# Altium schematic sheet OpenMoteSTM-Border_DP83848CVV.SchDoc
size A4
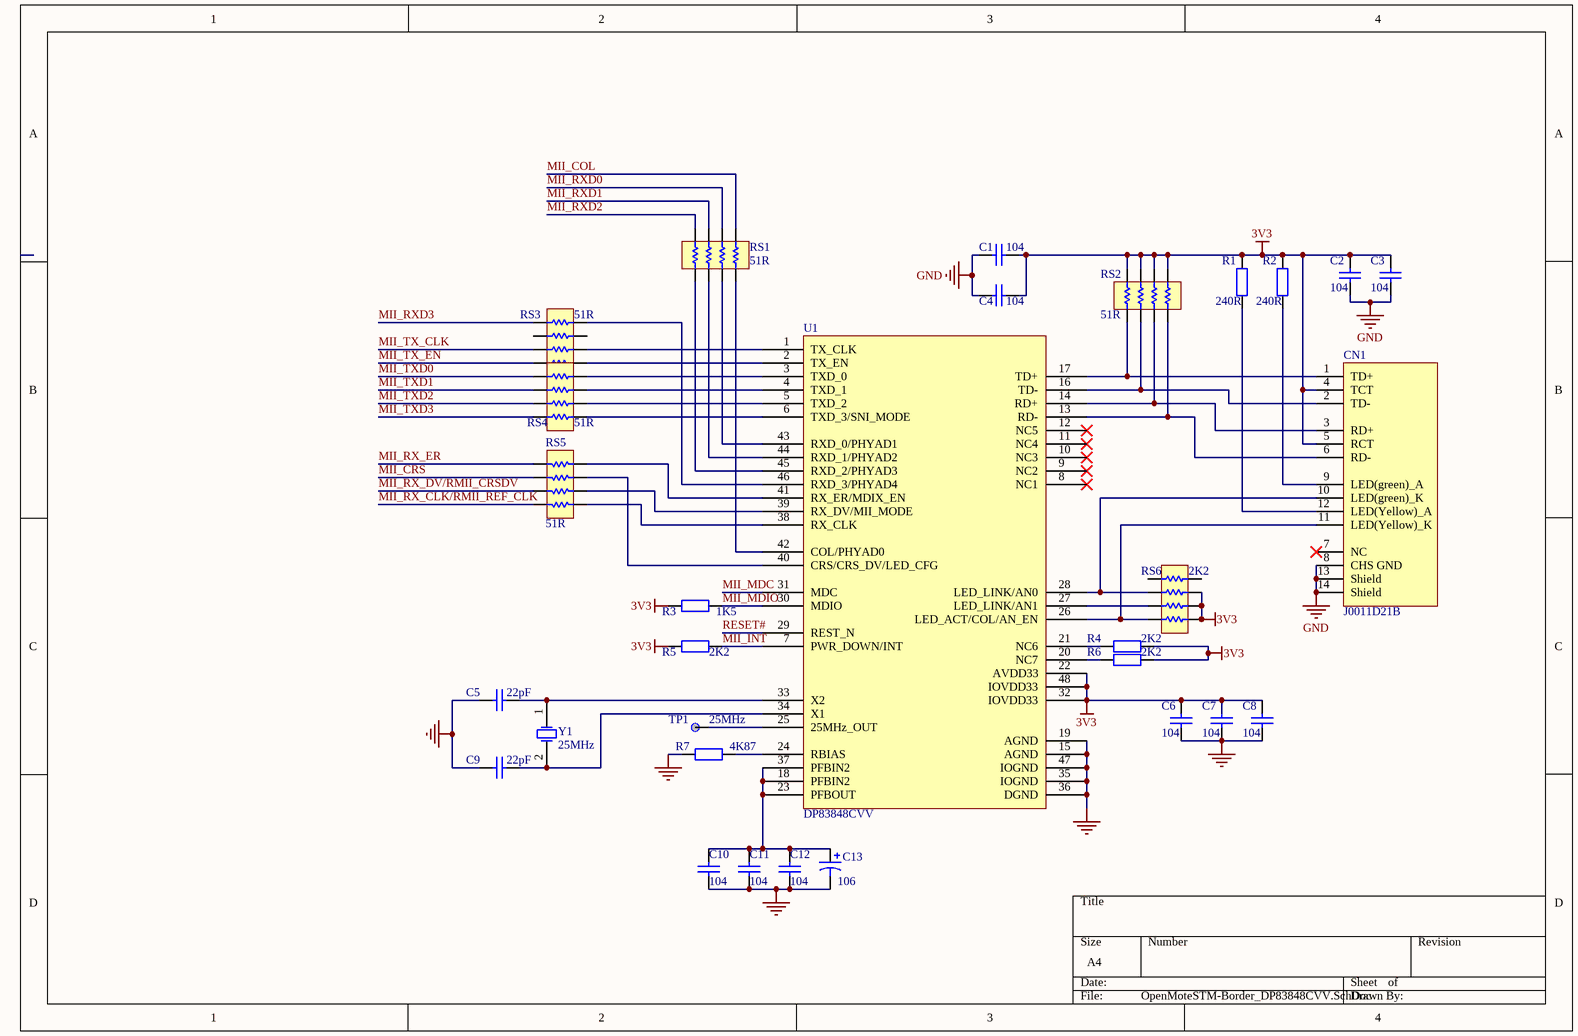
[diagram p0: OpenMoteSTM-Border_DP83848CVV.SchDoc]

## Parts
C1  value 104  [0603]  (hidden comment: Cap)
C2  value 104  [0603]  (hidden comment: Cap)
C3  value 104  [0603]  (hidden comment: Cap)
C4  value 104  [0603]  (hidden comment: Cap)
C5  value 22pF  [0603]  (hidden comment: Cap)
C6  value 104  [0603]  (hidden comment: Cap)
C7  value 104  [0603]  (hidden comment: Cap)
C8  value 104  [0603]  (hidden comment: Cap)
C9  value 22pF  [0603]  (hidden comment: Cap)
C10  value 104  [0603]  (hidden comment: Cap)
C11  value 104  [0603]  (hidden comment: Cap)
C12  value 104  [0603]  (hidden comment: Cap)
C13  value 106  [1210]  (hidden comment: Cap Pol1)
CN1  J0011D21B  [RJ45]
R1  value 240R  [0603]  (hidden comment: Res2)
R2  value 240R  [0603]  (hidden comment: Res2)
R3  value 1K5  [0603]  (hidden comment: Res2)
R4  value 2K2  [0603]  (hidden comment: Res2)
R5  value 2K2  [0603]  (hidden comment: Res2)
R6  value 2K2  [0603]  (hidden comment: Res2)
R7  value 4K87  [0603]  (hidden comment: Res2)
RS1  51R  [RES-4B]
RS2  51R  [RES-4B]
RS3  51R  [RES-4B]
RS4  51R  [RES-4B]
RS5  51R  [RES-4B]
RS6  2K2  [RES-4B]
TP1  25MHz  [TP]
U1  DP83848CVV  [DP83848CVV]
Y1  25MHz  [XTAL]

## Nets
3V3: C1.2 C2.2 C3.2 C4.2 C6.2 C7.2 C8.2 CN1.4(TCT) CN1.5(RCT) R1.2 R2.2 R3.1 R4.2 R5.1 R6.2 RS2.1 RS2.3 RS2.5 RS2.7 RS6.4 RS6.6 RS6.8 U1.22(AVDD33) U1.32(IOVDD33) U1.48(IOVDD33)
GND: C1.1 C2.1 C3.1 C4.1 C5.1 C6.1 C7.1 C8.1 C9.1 C10.1 C11.1 C12.1 C13.2 CN1.8(CHS_GND) CN1.13(Shield) CN1.14(Shield) R7.1 U1.15(AGND) U1.19(AGND) U1.35(IOGND) U1.36(DGND) U1.47(IOGND)
MII_COL: RS1.8
MII_CRS: RS5.4
MII_INT: R5.2 U1.7(PWR_DOWN/INT)
MII_MDC: U1.31(MDC)
MII_MDIO: R3.2 U1.30(MDIO)
MII_RX_CLK/RMII_REF_CLK: RS5.8
MII_RX_DV/RMII_CRSDV: RS5.6
MII_RX_ER: RS5.2
MII_RXD0: RS1.6
MII_RXD1: RS1.4
MII_RXD2: RS1.2
MII_RXD3: RS3.1
MII_TX_CLK: RS3.5
MII_TX_EN: RS3.7
MII_TXD0: RS4.1
MII_TXD1: RS4.3
MII_TXD2: RS4.5
MII_TXD3: RS4.7
RESET#: U1.29(REST_N)
NetC5_2: C5.2 U1.33(X2) Y1.1(OSC1)
NetC9_2: C9.2 U1.34(X1) Y1.2(OSC2)
NetC10_2: C10.2 C11.2 C12.2 C13.1 U1.18(PFBIN2) U1.23(PFBOUT) U1.37(PFBIN2)
NetCN1_1: CN1.1(TD+) RS2.8 U1.17(TD+)
NetCN1_2: CN1.2(TD-) RS2.6 U1.16(TD-)
NetCN1_3: CN1.3(RD+) RS2.4 U1.14(RD+)
NetCN1_6: CN1.6(RD-) RS2.2 U1.13(RD-)
NetCN1_9: CN1.9(LED(green)_A) R2.1
NetCN1_10: CN1.10(LED(green)_K) RS6.3 U1.28(LED_LINK/AN0)
NetCN1_11: CN1.11(LED(Yellow)_K) RS6.7 U1.26(LED_ACT/COL/AN_EN)
NetCN1_12: CN1.12(LED(Yellow)_A) R1.1
NetR4_1: R4.1 U1.21(NC6)
NetR6_1: R6.1 U1.20(NC7)
NetR7_2: R7.2 U1.24(RBIAS)
NetRS1_1: RS1.1 U1.45(RXD_2/PHYAD3)
NetRS1_3: RS1.3 U1.44(RXD_1/PHYAD2)
NetRS1_5: RS1.5 U1.43(RXD_0/PHYAD1)
NetRS1_7: RS1.7 U1.42(COL/PHYAD0)
NetRS3_2: RS3.2 U1.46(RXD_3/PHYAD4)
NetRS3_6: RS3.6 U1.1(TX_CLK)
NetRS3_8: RS3.8 U1.2(TX_EN)
NetRS4_2: RS4.2 U1.3(TXD_0)
NetRS4_4: RS4.4 U1.4(TXD_1)
NetRS4_6: RS4.6 U1.5(TXD_2)
NetRS4_8: RS4.8 U1.6(TXD_3/SNI_MODE)
NetRS5_1: RS5.1 U1.41(RX_ER/MDIX_EN)
NetRS5_3: RS5.3 U1.40(CRS/CRS_DV/LED_CFG)
NetRS5_5: RS5.5 U1.39(RX_DV/MII_MODE)
NetRS5_7: RS5.7 U1.38(RX_CLK)
NetRS6_5: RS6.5 U1.27(LED_LINK/AN1)
NetTP1_1: TP1.1 U1.25(25MHz_OUT)

Not connected (* = marked no-connect by the designer): CN1 7(NC)*; RS3 3 4; RS6 1 2; U1 8(NC1)* 9(NC2)* 10(NC3)* 11(NC4)* 12(NC5)*

## Library data of the parts
C1-C12 = Cap: Capacitor; Published: 8-Jun-2000; LatestRevisionDate: 17-Jul-2002; LatestRevisionNote: Re-released for DXP Platform.; PackageReference: RAD-0.3; Publisher: Altium Limited
C13 = Cap Pol1: Polarized Capacitor (Radial); Published: 8-Jun-2000; LatestRevisionDate: 17-Jul-2002; LatestRevisionNote: Re-released for DXP Platform.; PackageReference: RB7.6-15; Publisher: Altium Limited
R1-R7 = Res2: Resistor; Published: 8-Jun-2000; LatestRevisionDate: 17-Jul-2002; LatestRevisionNote: Re-released for DXP Platform.; PackageReference: AXIAL-0.4; Publisher: Altium Limited
RS1-RS6 = Resister Array
TP1 = TP
Y1 = XTAL: Crystal Oscillator; Published: 8-Jun-2000; LatestRevisionDate: 17-Jul-2002; LatestRevisionNote: Re-released for DXP Platform.; PackageReference: R38; Publisher: Altium Limited